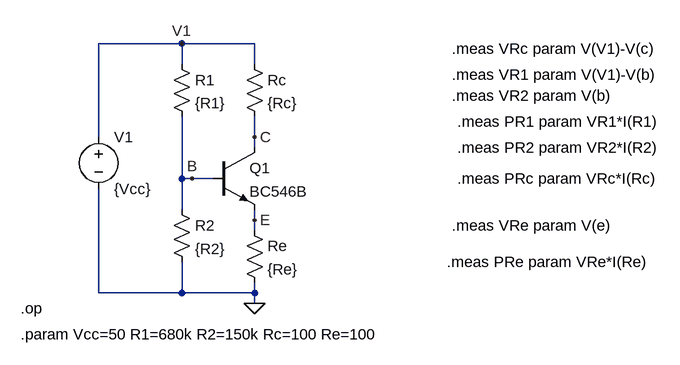
[diagram p0: schematic TBJ06a.asc]
TBJ06a.asc, the LTspice schematic file:
Version 4
SHEET 1 1016 680
WIRE 256 -32 128 -32
WIRE 368 -32 256 -32
WIRE 256 0 256 -32
WIRE 368 0 368 -32
WIRE 128 112 128 -32
WIRE 368 112 368 80
WIRE 368 128 368 112
WIRE 256 176 256 80
WIRE 272 176 256 176
WIRE 304 176 272 176
WIRE 256 224 256 176
WIRE 368 240 368 224
WIRE 368 256 368 240
WIRE 128 352 128 192
WIRE 256 352 256 304
WIRE 256 352 128 352
WIRE 368 352 368 336
WIRE 368 352 256 352
WIRE 368 368 368 352
FLAG 368 368 0
FLAG 272 176 B
FLAG 368 112 C
FLAG 256 -32 V1
FLAG 368 240 E
SYMBOL voltage 128 96 R0
WINDOW 123 0 0 Left 0
WINDOW 39 0 0 Left 0
SYMATTR InstName V1
SYMATTR Value {Vcc}
SYMBOL res 240 -16 R0
SYMATTR InstName R1
SYMATTR Value {R1}
SYMBOL res 352 -16 R0
SYMATTR InstName Rc
SYMATTR Value {Rc}
SYMBOL npn 304 128 R0
SYMATTR InstName Q1
SYMATTR Value BC546B
SYMBOL res 352 240 R0
SYMATTR InstName Re
SYMATTR Value {Re}
SYMBOL res 240 208 R0
SYMATTR InstName R2
SYMATTR Value {R2}
TEXT 8 376 Left 2 !.op
TEXT 8 416 Left 2 !.param Vcc=50 R1=680k R2=150k Rc=100 Re=100
TEXT 672 -24 Left 2 !.meas VRc param V(V1)-V(c)
TEXT 672 16 Left 2 !.meas VR1 param V(V1)-V(b)
TEXT 680 128 Left 2 !.meas PR2 param VR2*I(R2)
TEXT 680 176 Left 2 !.meas PRc param VRc*I(Rc)
TEXT 672 248 Left 2 !.meas VRe param V(e)
TEXT 664 304 Left 2 !.meas PRe param VRe*I(Re)
TEXT 672 48 Left 2 !.meas VR2 param V(b)
TEXT 680 88 Left 2 !.meas PR1 param VR1*I(R1)

The netlist it stands for:
* TBJ06a.asc
V1 V1 0 {Vcc}
R1 V1 B {R1}
Rc V1 C {Rc}
Q1 C B E 0 BC546B
Re E 0 {Re}
R2 B 0 {R2}
.model NPN NPN
.model PNP PNP
.lib standard.bjt
.op
.param Vcc=50 R1=680k R2=150k Rc=100 Re=100
.meas VRc param V(V1)-V(c)
.meas VR1 param V(V1)-V(b)
.meas PR2 param VR2*I(R2)
.meas PRc param VRc*I(Rc)
.meas VRe param V(e)
.meas PRe param VRe*I(Re)
.meas VR2 param V(b)
.meas PR1 param VR1*I(R1)
.backanno
.end